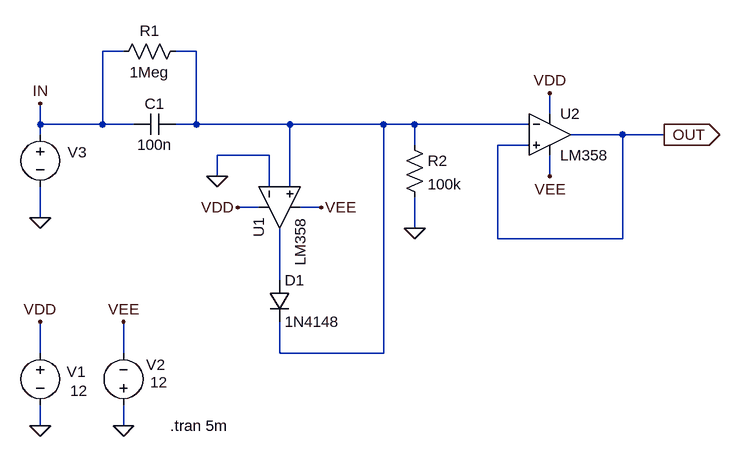
[diagram p0: schematic v1.0.asc]
* v1.0.asc
C1 N001 IN 100n
R1 N001 IN 1Meg
* U1: LM358 (symbol MyLib\OpAmp\LM358 not available, pins judged from their places): In+=N001 In-=0 V+=VDD V-=VEE OUT=N002
V1 VDD 0 12
V2 0 VEE 12
R2 N001 0 100k
* U2: LM358 (symbol MyLib\OpAmp\LM358 not available, pins judged from their places): In+=OUT In-=N001 V+=VDD V-=VEE OUT=OUT
V3 IN 0 PULSE(-3.3 3.3 0 1n 1n {0.5/1k} {1/1k})
D1 N002 N001 1N4148
.model D D
.lib standard.dio
.tran 5m
.backanno
.end

* Results of the author's LTspice run, read from the files saved beside the schematic
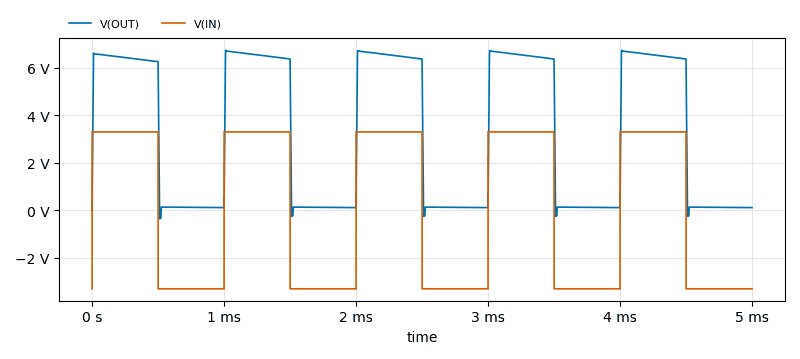
[diagram p1: Transient Analysis of v1.0.asc, plotted from the saved traces]
* Transient Analysis, 1 run:
*   V(OUT): min -353.8 mV, max 6.732 V, average 3.315 V, rms 4.593 V, last 116 mV
*   V(IN): min -3.3 V, max 3.3 V, average 6.6 µV, rms 3.3 V, last -3.3 V